# EAGLE design primary_cap_board_4s2p (EAGLE 6.1)
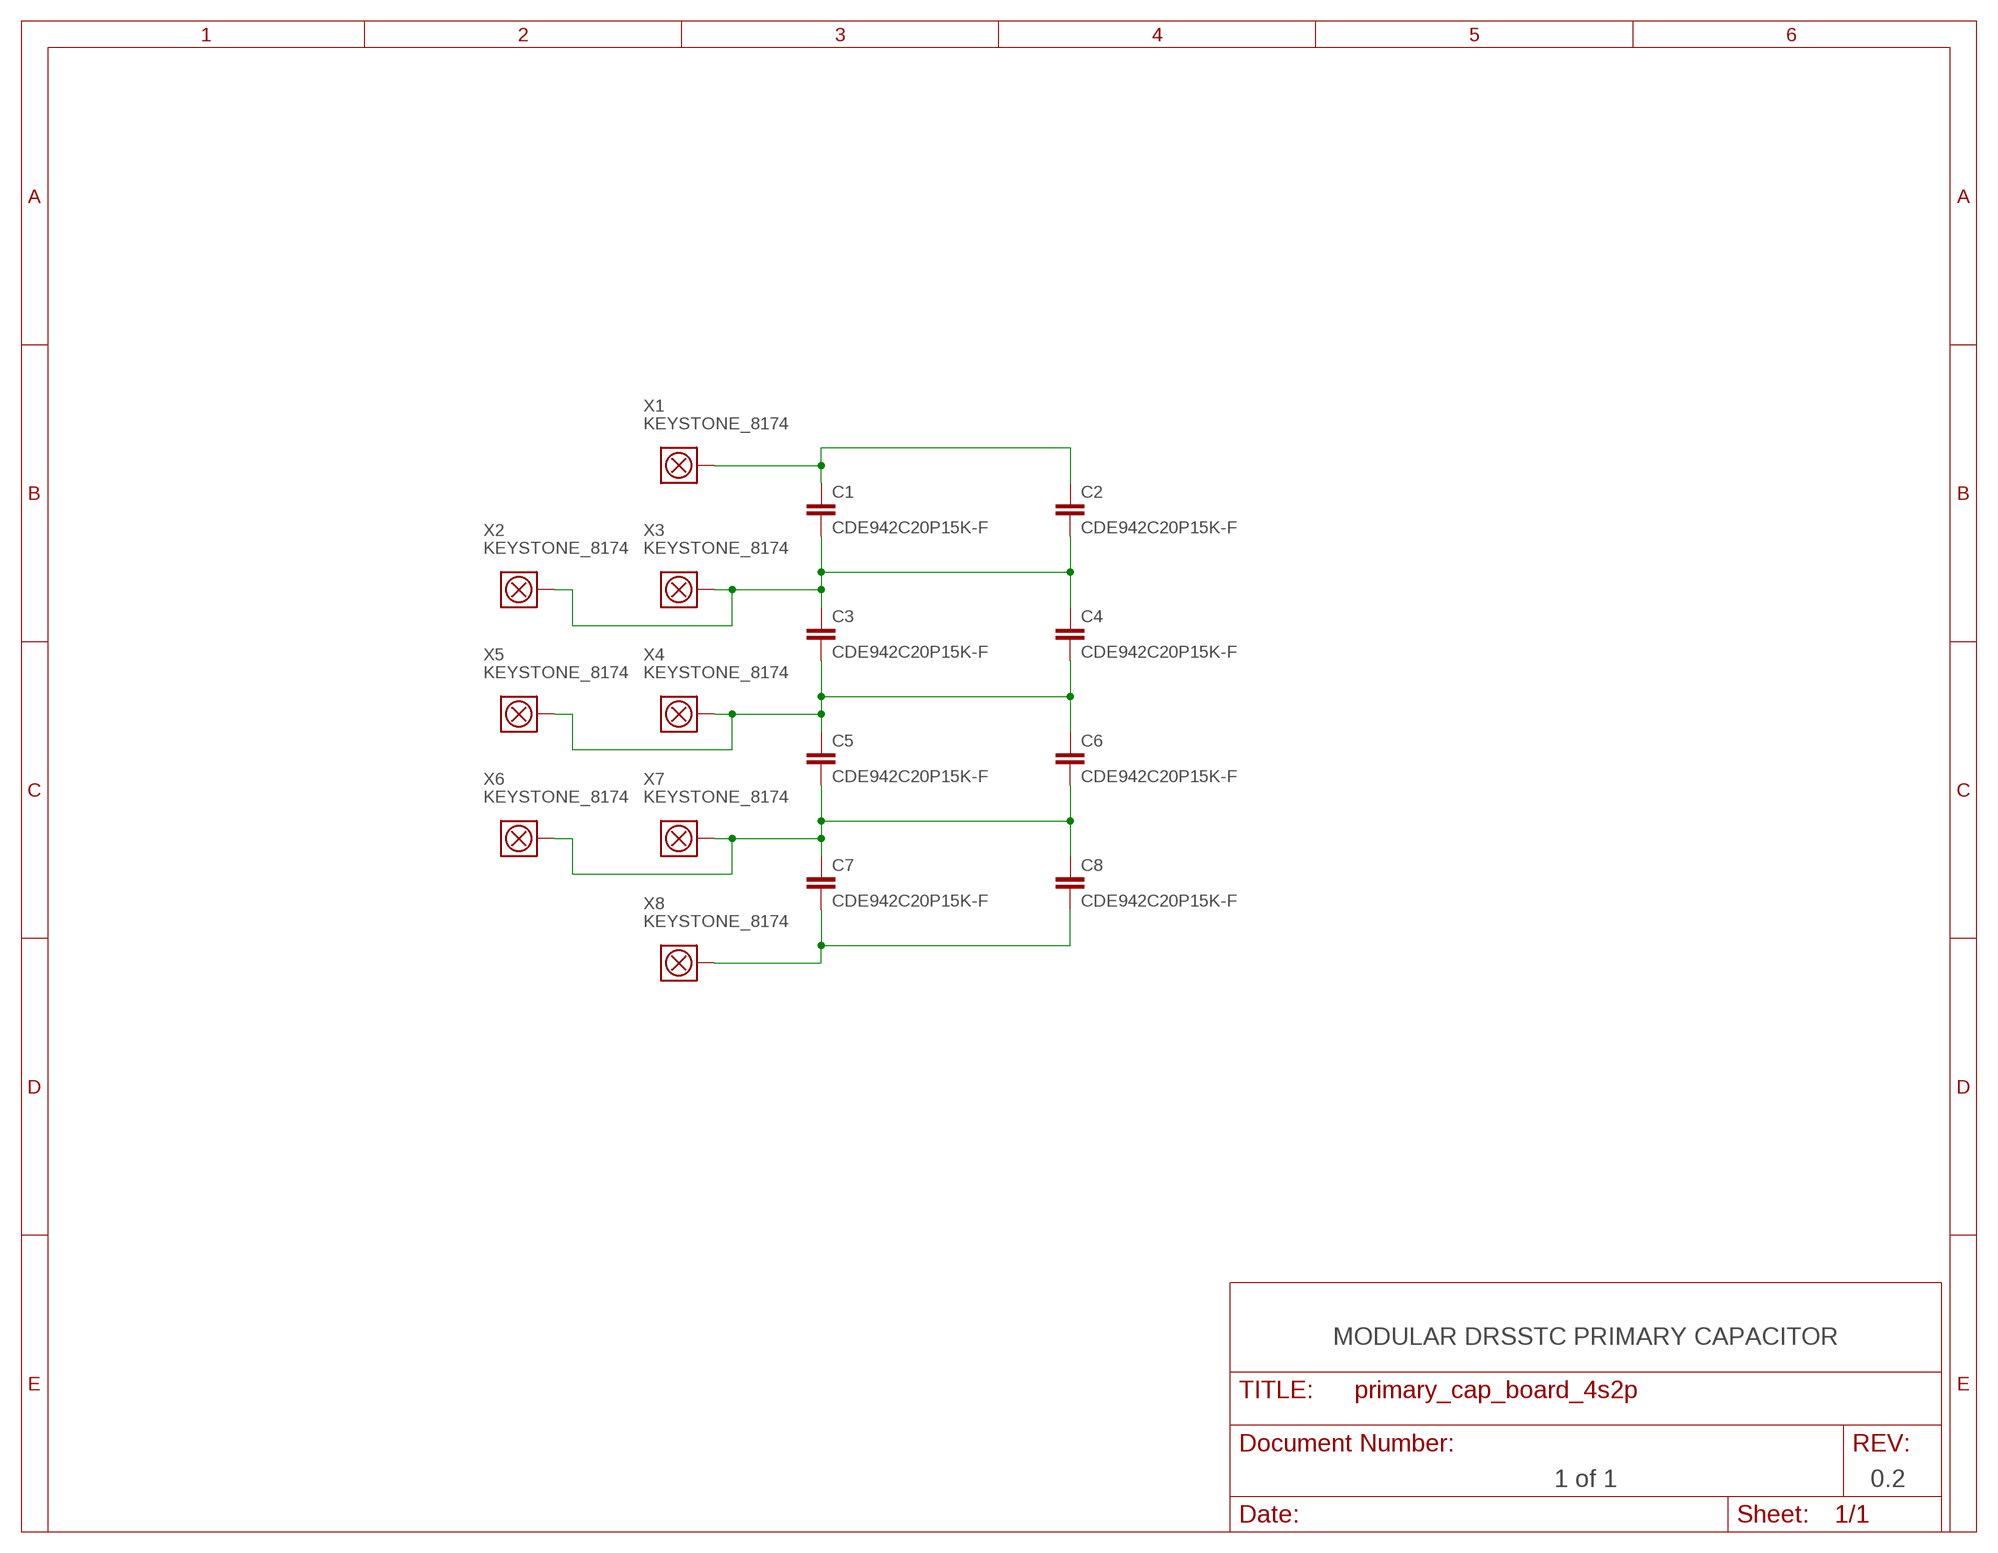
[diagram p0: schematic, sheet 1]

## Parts
C1  CDE942C20P15K-F  [CDE942]
C2  CDE942C20P15K-F  [CDE942]
C3  CDE942C20P15K-F  [CDE942]
C4  CDE942C20P15K-F  [CDE942]
C5  CDE942C20P15K-F  [CDE942]
C6  CDE942C20P15K-F  [CDE942]
C7  CDE942C20P15K-F  [CDE942]
C8  CDE942C20P15K-F  [CDE942]
X1  KEYSTONE_8174  CON_KEYSTONE_8174  [CON_KEYSTONE_8174]
X2  KEYSTONE_8174  CON_KEYSTONE_8174  [CON_KEYSTONE_8174]
X3  KEYSTONE_8174  CON_KEYSTONE_8174  [CON_KEYSTONE_8174]
X4  KEYSTONE_8174  CON_KEYSTONE_8174  [CON_KEYSTONE_8174]
X5  KEYSTONE_8174  CON_KEYSTONE_8174  [CON_KEYSTONE_8174]
X6  KEYSTONE_8174  CON_KEYSTONE_8174  [CON_KEYSTONE_8174]
X7  KEYSTONE_8174  CON_KEYSTONE_8174  [CON_KEYSTONE_8174]
X8  KEYSTONE_8174  CON_KEYSTONE_8174  [CON_KEYSTONE_8174]

## Nets
N$1: C1.P$2 C2.P$2 C3.P$1 C4.P$1 X2.P$1(PIN1) X2.P$2(PIN1) X2.P$3(PIN1) X2.P$4(PIN1) X3.P$1(PIN1) X3.P$2(PIN1) X3.P$3(PIN1) X3.P$4(PIN1)
N$4: C3.P$2 C4.P$2 C5.P$1 C6.P$1 X4.P$1(PIN1) X4.P$2(PIN1) X4.P$3(PIN1) X4.P$4(PIN1) X5.P$1(PIN1) X5.P$2(PIN1) X5.P$3(PIN1) X5.P$4(PIN1)
N$5: C5.P$2 C6.P$2 C7.P$1 C8.P$1 X6.P$1(PIN1) X6.P$2(PIN1) X6.P$3(PIN1) X6.P$4(PIN1) X7.P$1(PIN1) X7.P$2(PIN1) X7.P$3(PIN1) X7.P$4(PIN1)
N$7: C7.P$2 C8.P$2 X8.P$1(PIN1) X8.P$2(PIN1) X8.P$3(PIN1) X8.P$4(PIN1)
N$8: C1.P$1 C2.P$1 X1.P$1(PIN1) X1.P$2(PIN1) X1.P$3(PIN1) X1.P$4(PIN1)

## Notes on the sheet
- MODULAR DRSSTC PRIMARY CAPACITOR
- 1 of 1 | 0.2

## Library data of the parts
C1-C8 = Kramnik's Library:CDE942C20P15K-F
X1-X8 = Kramnik's Library:CON_KEYSTONE_8174

## Board
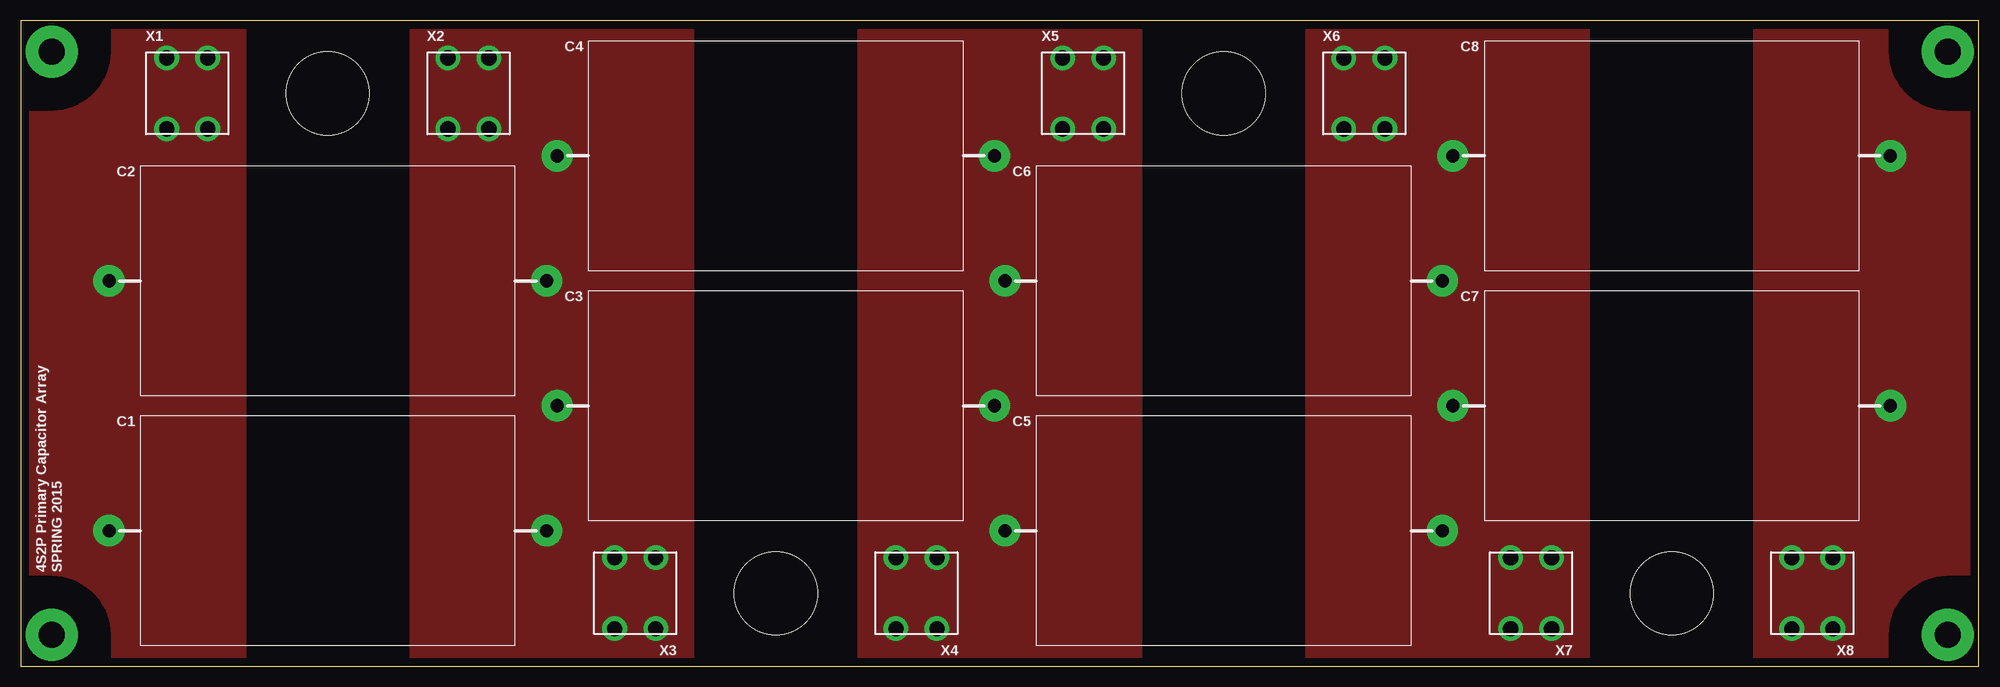
[diagram p1: board, top side]
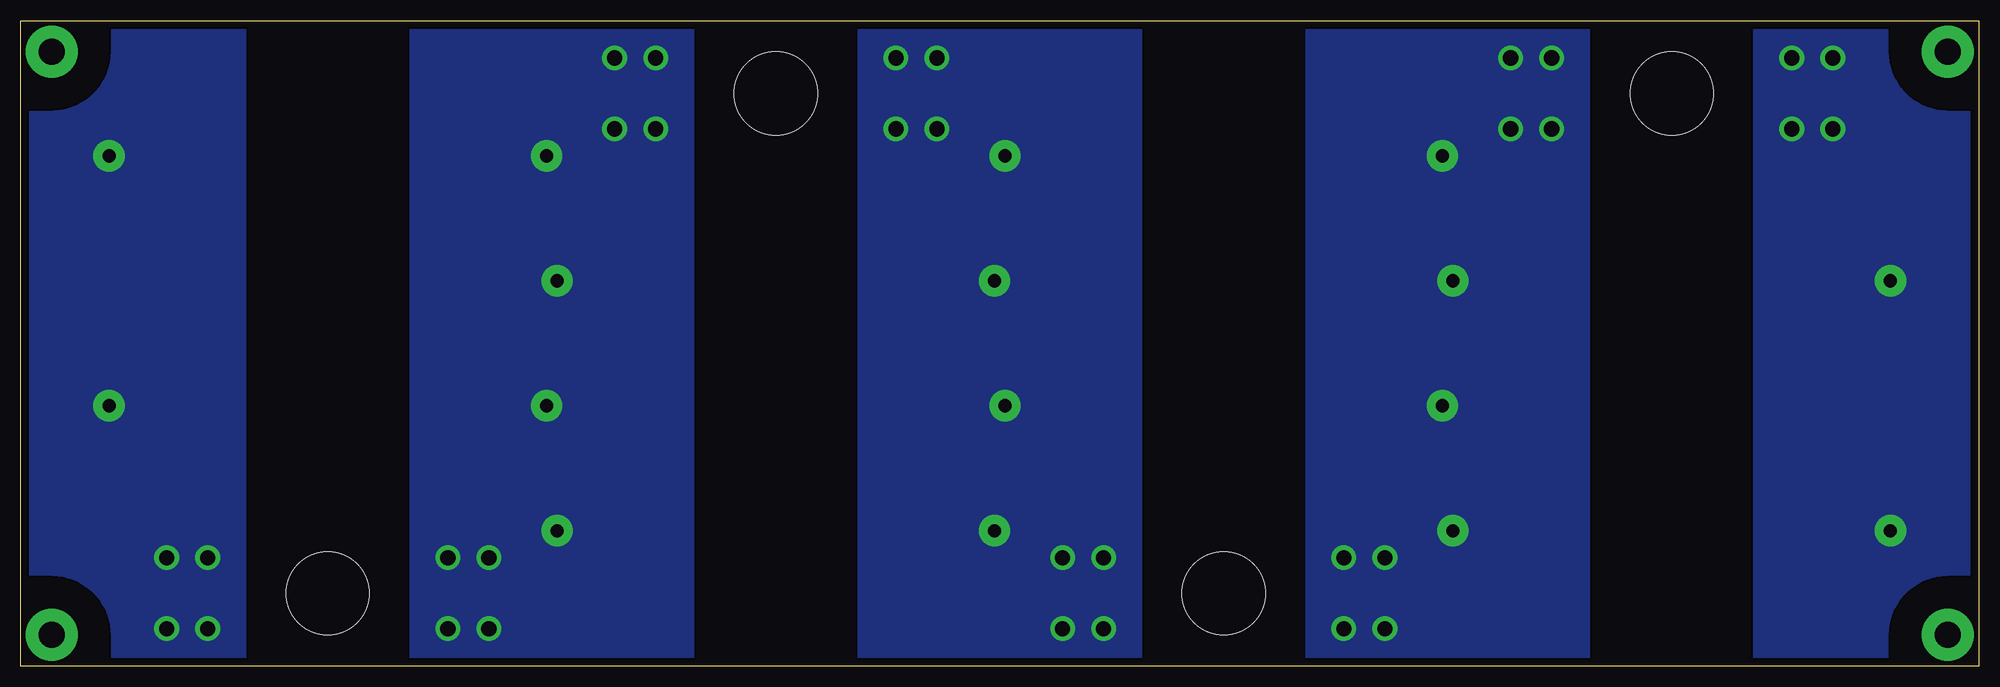
[diagram p2: board, bottom side, seen from below]

Size 238.76 x 78.74 mm. Coordinates in mm from the lower left corner, seen from the top.
Outline: 0,0 238.76,0 238.76,78.74 0,78.74 0,0
Copper layers (1*16): Top 0.035mm / dielectric 1.5mm / Bottom 0.035mm
Design rules: minimum track width 10mil, minimum drill 24mil, track to track 100mil, track to pad 100mil, pad to pad 100mil, via to via 100mil, smd to smd 0mil, copper to edge 40mil, drill to drill 8mil, minimum pad ring 10mil, minimum via ring 8mil, stop-mask expansion 4mil, vias tented up to drill 0mil, thermal gap 10mil
Holes 10.16 mm at 201.29,8.89 92.08,8.89 146.69,69.85 37.47,69.85
tRestrict: 20 lines
bRestrict: 20 lines

### Footprints (pad centres in the part's own frame; a part is rotated, then mirrored left to right if it is on the bottom)
CDE942 = drill 1.6 pad 3.81: P$1 -27.94,0; P$2 25.4,0
CON_KEYSTONE_8174 = drill 1.85 pad 3: P$1 -2.5,4.33; P$2 -2.5,-4.33; P$3 2.5,-4.33; P$4 2.5,4.33

### Placement (x,y rotation side)
C1  38.73,16.51 0 top
C2  38.73,46.99 0 top
C3  93.34,31.75 0 top
C4  93.34,62.23 0 top
C5  147.96,16.51 0 top
C6  147.96,46.99 0 top
C7  202.56,31.75 0 top
C8  202.56,62.23 0 top
X1  20.32,69.85 0 top
X2  54.61,69.85 0 top
X3  74.93,8.89 0 top
X4  109.22,8.89 0 top
X5  129.54,69.85 0 top
X6  163.83,69.85 0 top
X7  184.15,8.89 0 top
X8  218.44,8.89 0 top

### Tracks (layer width: path | path; a pad name or v marks a point on that pad's centre or on a via)
N$1
  pour Bottom (no thermals): 47.62,78.74 81.92,78.74 81.92,0 47.62,0
  pour Top (no thermals): 47.62,78.74 81.92,78.74 81.92,0 47.62,0
N$2  (via drill 3.2 pad 6.35)
  other vias: 234.95,74.93
N$3  (via drill 3.2 pad 6.35)
  other vias: 234.95,3.81
N$4
  pour Bottom (no thermals): 102.23,78.74 136.53,78.74 136.53,0 102.23,0
  pour Top (no thermals): 136.53,78.74 136.53,0 102.23,0 102.23,78.74
N$5
  pour Bottom (no thermals): 156.84,78.74 191.13,78.74 191.13,0 156.84,0
  pour Top (no thermals): 191.13,78.74 191.13,0 156.84,0 156.84,78.74
N$6  (via drill 3.2 pad 6.35)
  other vias: 3.81,74.93
N$7
  pour Top (no thermals): 211.46,78.74 238.76,78.74 238.76,0 211.46,0
  pour Bottom (no thermals): 238.76,78.74 238.76,0 211.46,0 211.46,78.74
N$8
  pour Top (no thermals): 27.3,0 27.3,80.01 0,80.01 0,0
  pour Bottom (no thermals): 27.3,79.38 27.3,0 0,0 -1.91,79.38
N$9  (via drill 3.2 pad 6.35)
  other vias: 3.81,3.81

### Text on the board
tPlace: 4S2P Primary Capacitor Array | SPRING 2015